# EAGLE design Electronicsmb (EAGLE 9.1.1)
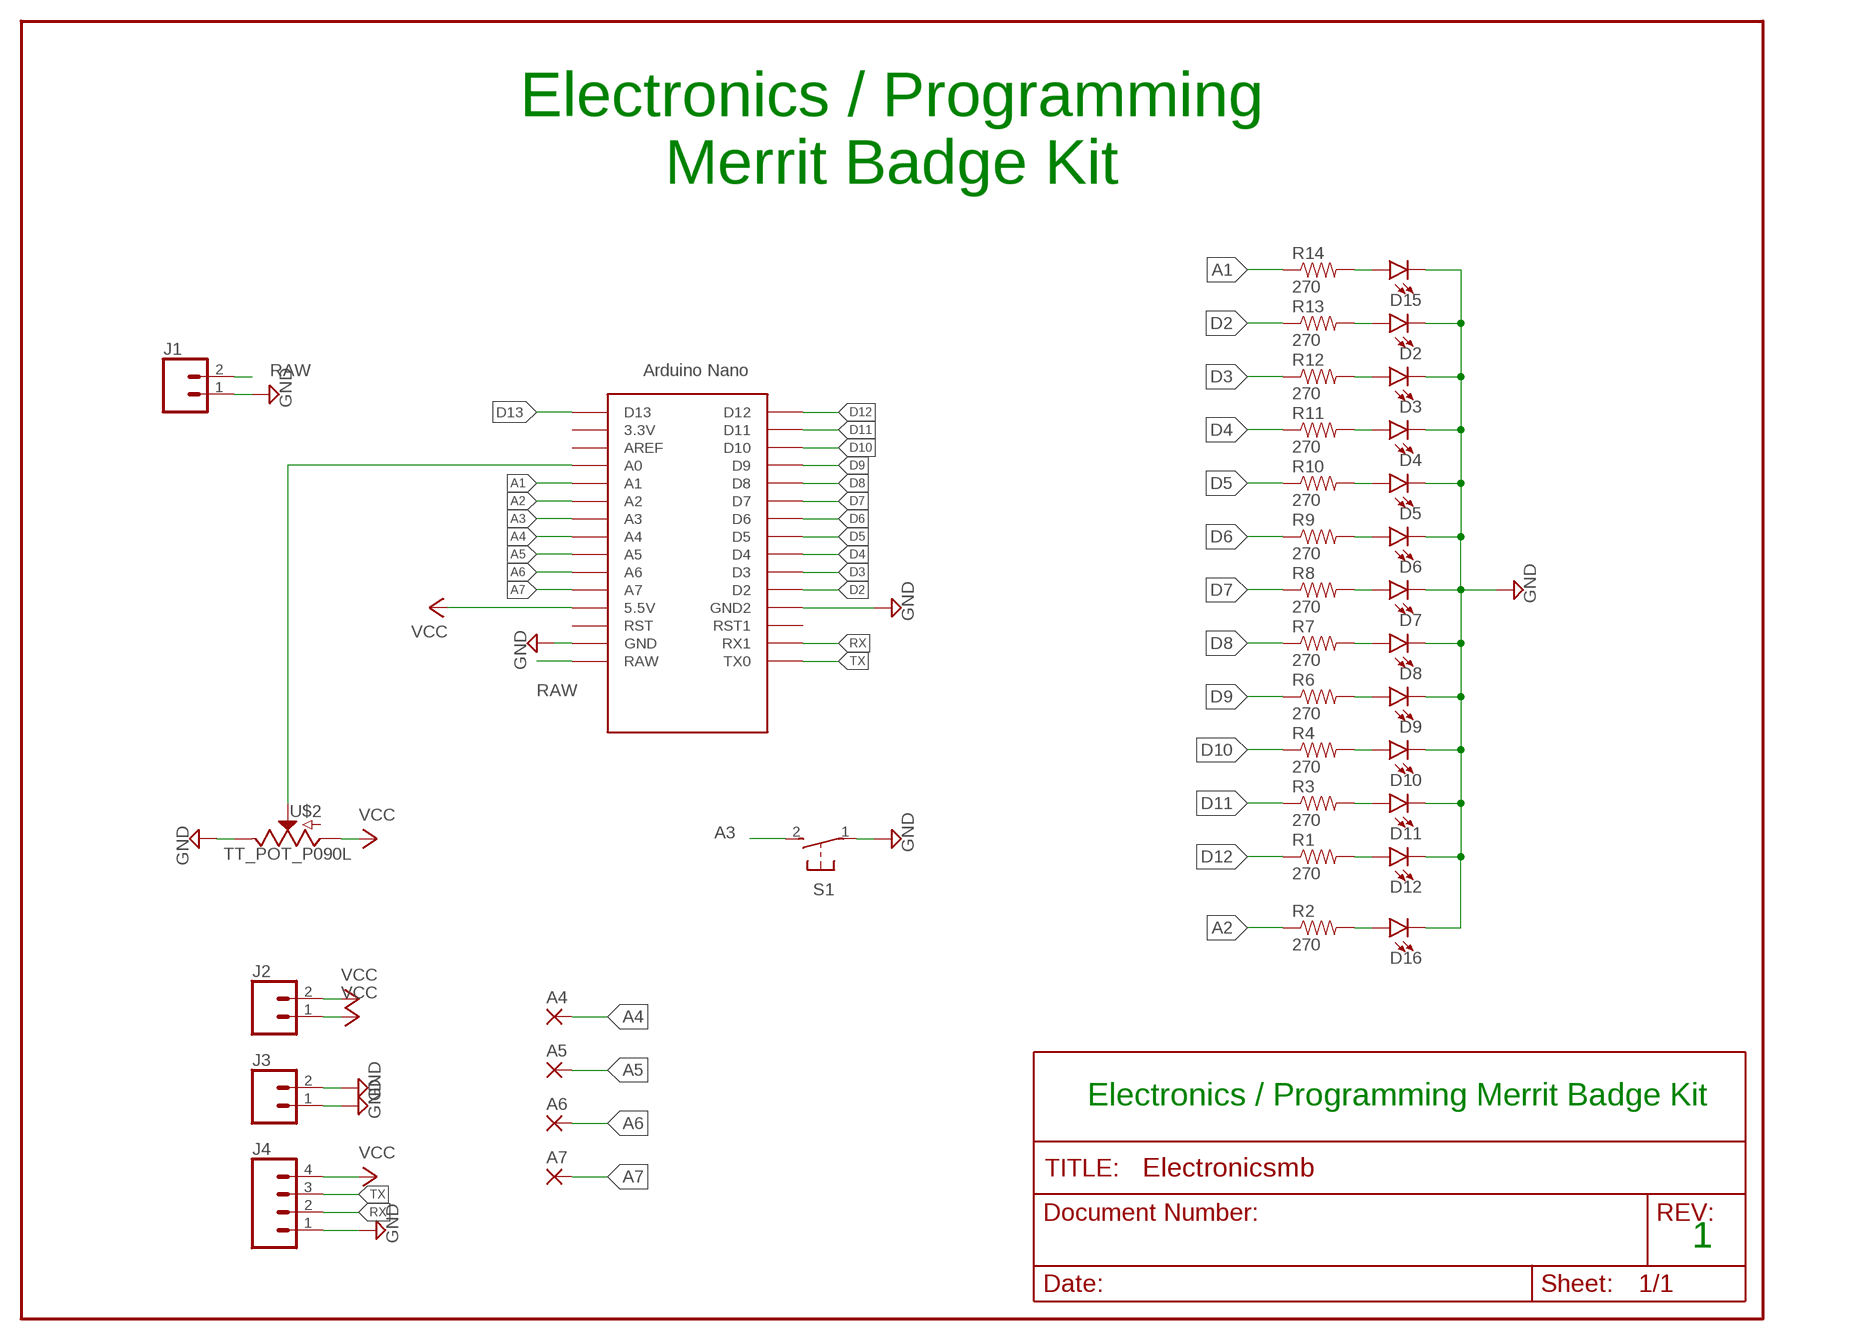
[diagram p0: schematic, sheet 1]

## Parts
A4  2,54/1,0  [2,54/1,0]
A5  2,54/1,0  [2,54/1,0]
A6  2,54/1,0  [2,54/1,0]
A7  2,54/1,0  [2,54/1,0]
D2  LED5MM  [LED_5MM]
D3  LED5MM  [LED_5MM]
D4  LED5MM  [LED_5MM]
D5  LED5MM  [LED_5MM]
D6  LED5MM  [LED_5MM]
D7  LED5MM  [LED_5MM]
D8  LED5MM  [LED_5MM]
D9  LED5MM  [LED_5MM]
D10  LED5MM  [LED_5MM]
D11  LED5MM  [LED_5MM]
D12  LED5MM  [LED_5MM]
D15  LED5MM  [LED_5MM]
D16  LED5MM  [LED_5MM]
J1  CONN_02  [1X02]
J2  CONN_02  [1X02]
J3  CONN_02  [1X02]
J4  CONN_04  [1X04]
R1  270  RESISTORPTH-1/4W  [AXIAL-0.4]
R2  270  RESISTORPTH-1/4W  [AXIAL-0.4]
R3  270  RESISTORPTH-1/4W  [AXIAL-0.4]
R4  270  RESISTORPTH-1/4W  [AXIAL-0.4]
R6  270  RESISTORPTH-1/4W  [AXIAL-0.4]
R7  270  RESISTORPTH-1/4W  [AXIAL-0.4]
R8  270  RESISTORPTH-1/4W  [AXIAL-0.4]
R9  270  RESISTORPTH-1/4W  [AXIAL-0.4]
R10  270  RESISTORPTH-1/4W  [AXIAL-0.4]
R11  270  RESISTORPTH-1/4W  [AXIAL-0.4]
R12  270  RESISTORPTH-1/4W  [AXIAL-0.4]
R13  270  RESISTORPTH-1/4W  [AXIAL-0.4]
R14  270  RESISTORPTH-1/4W  [AXIAL-0.4]
S1  31-XX  [B3F-31XX]
U$1  NANO  [NANO]
U$2  TT_POT_P090L  [TT_POT]

## Nets
A1: R14.P$1 U$1.A1
A2: R2.P$1 U$1.A2
A3: S1.2(S) U$1.A3
A4: A4.1(P) U$1.A4
A5: A5.1(P) U$1.A5
A6: A6.1(P) U$1.A6
A7: A7.1(P) U$1.A7
D2: R13.P$1 U$1.D2
D3: R12.P$1 U$1.D3
D4: R11.P$1 U$1.D4
D5: R10.P$1 U$1.D5
D6: R9.P$1 U$1.D6
D7: R8.P$1 U$1.D7
D8: R7.P$1 U$1.D8
D9: R6.P$1 U$1.D9
D10: R4.P$1 U$1.D10
D11: R3.P$1 U$1.D11
D12: R1.P$1 U$1.D12
D13: U$1.D13
GND: D2.K(C) D3.K(C) D4.K(C) D5.K(C) D6.K(C) D7.K(C) D8.K(C) D9.K(C) D10.K(C) D11.K(C) D12.K(C) D15.K(C) D16.K(C) J1.1 J3.1 J3.2 J4.1 S1.1(P) U$1.GND U$1.GND1(GND2) U$2.P$3(E)
N$13: D16.A R2.P$2
N$15: D15.A R14.P$2
N$16: D2.A R13.P$2
N$17: D3.A R12.P$2
N$18: D4.A R11.P$2
N$19: D5.A R10.P$2
N$20: D6.A R9.P$2
N$21: D7.A R8.P$2
N$22: D8.A R7.P$2
N$23: D9.A R6.P$2
N$24: D10.A R4.P$2
N$25: D11.A R3.P$2
N$26: D12.A R1.P$2
N$27: U$1.A0 U$2.P$2(S)
RAW: J1.2 U$1.RAW
RX: J4.2 U$1.RX1
TX: J4.3 U$1.TX0
VCC: J2.1 J2.2 J4.4 U$1.5V(5.5V) U$2.P$1(A)
Unconnected: U$1.3.3V U$1.AREF U$1.ICSP1 U$1.ICSP2 U$1.ICSP3 U$1.ICSP4 U$1.ICSP5 U$1.ICSP6 U$1.RST U$1.RST1

## Notes on the sheet
- Electronics / Programming
  Merrit Badge Kit
- Electronics / Programming Merrit Badge Kit
- 1

## Library data of the parts
A4-A7 = wirepad:2,54/1,0: THROUGH-HOLE PAD
D2-D12 D15 D16 = SparkFun-LED:LED: LED (Generic) Standard schematic elements and footprints for 5mm, 3mm, 1206, and 0603 sized LEDs. Generic LEDs with no color specified.
J1-J3 = SparkFun-Connectors:CONN_02: Multi connection point. Often used as Generic Header-pin footprint for 0.1 inch spaced/style header connections On any of the 0.1 inch spaced packages, you can populate with these: Break Away Headers - Straight <https://www.sparkfun.com/products/116> (PRT-00116) Break Away Male Headers - Right Angle <https://www.sparkfun.com/products/553> (PRT-00553) Female Headers <https://www.sparkfun.com/products/115> (PRT-00115) Break Away Headers - Machine Pin <https://www.sparkfun.com/products/117> (PRT-00117) Break Away Female Headers - Swiss Machine Pin <https://www.sparkfun.com/products/743> (PRT-00743) For SCREWTERMINALS and SPRING TERMINALS visit here: Screw Terimnals on SparkFun.com <https://www.sparkfun.com/search/results?term=Screw+Terminals> (5mm/3.5mm/2.54mm spacing) This device is also useful as a general connection point to wire up your design to another part of your project. Our various solder wires solder well into these plated through hole pads. Hook-Up Wire - Assortment (Stranded, 22 AWG) <https://www.sparkfun.com/products/11375> (PRT-11375) Hook-Up Wire - Assortment (Solid Core, 22 AWG) <https://www.sparkfun.com/products/11367> (PRT-11367) View the entire wire category on our website here <https://www.sparkfun.com/categories/141> Special notes: Molex polarized connector foot print use with: PRT-08233 with associated crimp pins and housings. 2.54_SCREWTERM for use with PRT-10571. 3.5mm Screw Terminal footprints for PRT-08084 5mm Screw Terminal footprints for use with PRT-08432
J4 = SparkFun-Connectors:CONN_04: Multi connection point. Often used as Generic Header-pin footprint for 0.1 inch spaced/style header connections On any of the 0.1 inch spaced packages, you can populate with these: Break Away Headers - Straight <https://www.sparkfun.com/products/116> (PRT-00116) Break Away Male Headers - Right Angle <https://www.sparkfun.com/products/553> (PRT-00553) Female Headers <https://www.sparkfun.com/products/115> (PRT-00115) Break Away Headers - Machine Pin <https://www.sparkfun.com/products/117> (PRT-00117) Break Away Female Headers - Swiss Machine Pin <https://www.sparkfun.com/products/743> (PRT-00743) For SCREWTERMINALS and SPRING TERMINALS visit here: Screw Terimnals on SparkFun.com <https://www.sparkfun.com/search/results?term=Screw+Terminals> (5mm/3.5mm/2.54mm spacing) This device is also useful as a general connection point to wire up your design to another part of your project. Our various solder wires solder well into these plated through hole pads. Hook-Up Wire - Assortment (Stranded, 22 AWG) <https://www.sparkfun.com/products/11375> (PRT-11375) Hook-Up Wire - Assortment (Solid Core, 22 AWG) <https://www.sparkfun.com/products/11367> (PRT-11367) View the entire wire category on our website here <https://www.sparkfun.com/categories/141> Special notes: Molex polarized connector foot print use with SKU : PRT-08231 with associated crimp pins and housings. 1MM SMD Version SKU: PRT-10208; PROD_ID: CONN-09696
R1-R4 R6-R14 = SparkFun:RESISTOR: Resistor Basic schematic elements and footprints for 0603, 1206, and PTH resistors.
S1 = switch-omron:31-XX: OMRON SWITCH; MPN: B3F-3100; OC_FARNELL: 959704; OC_NEWARK: 36M3582
U$1 = Arduino-clone:NANO: Arduino Nano
U$2 = homemadehamcustom:TT_POT_P090L

## Board
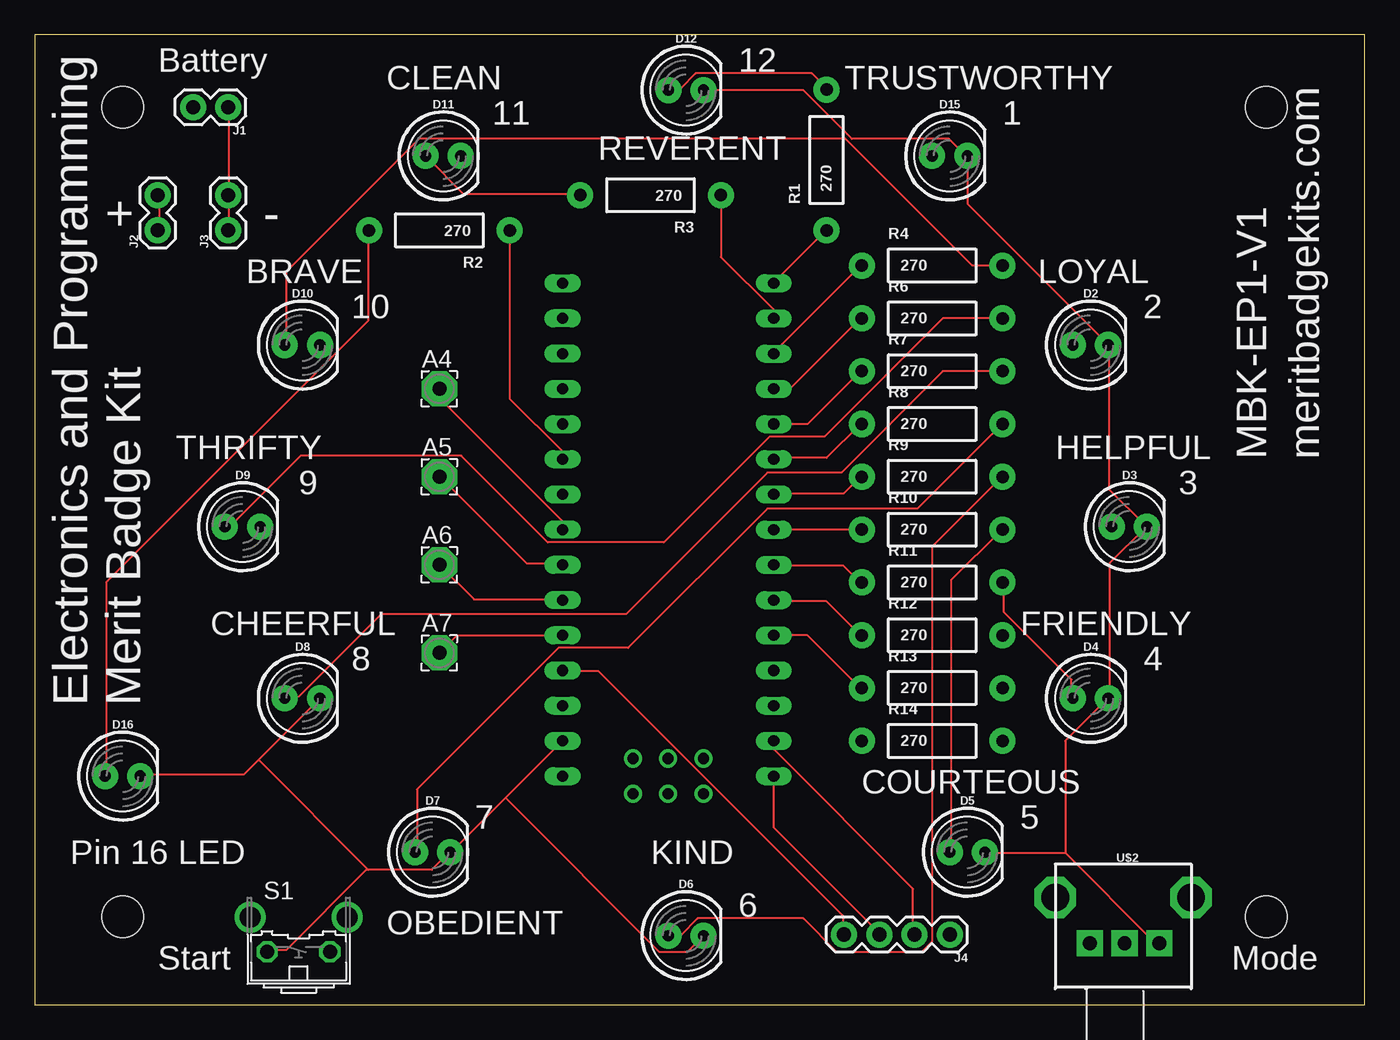
[diagram p1: board, top side]
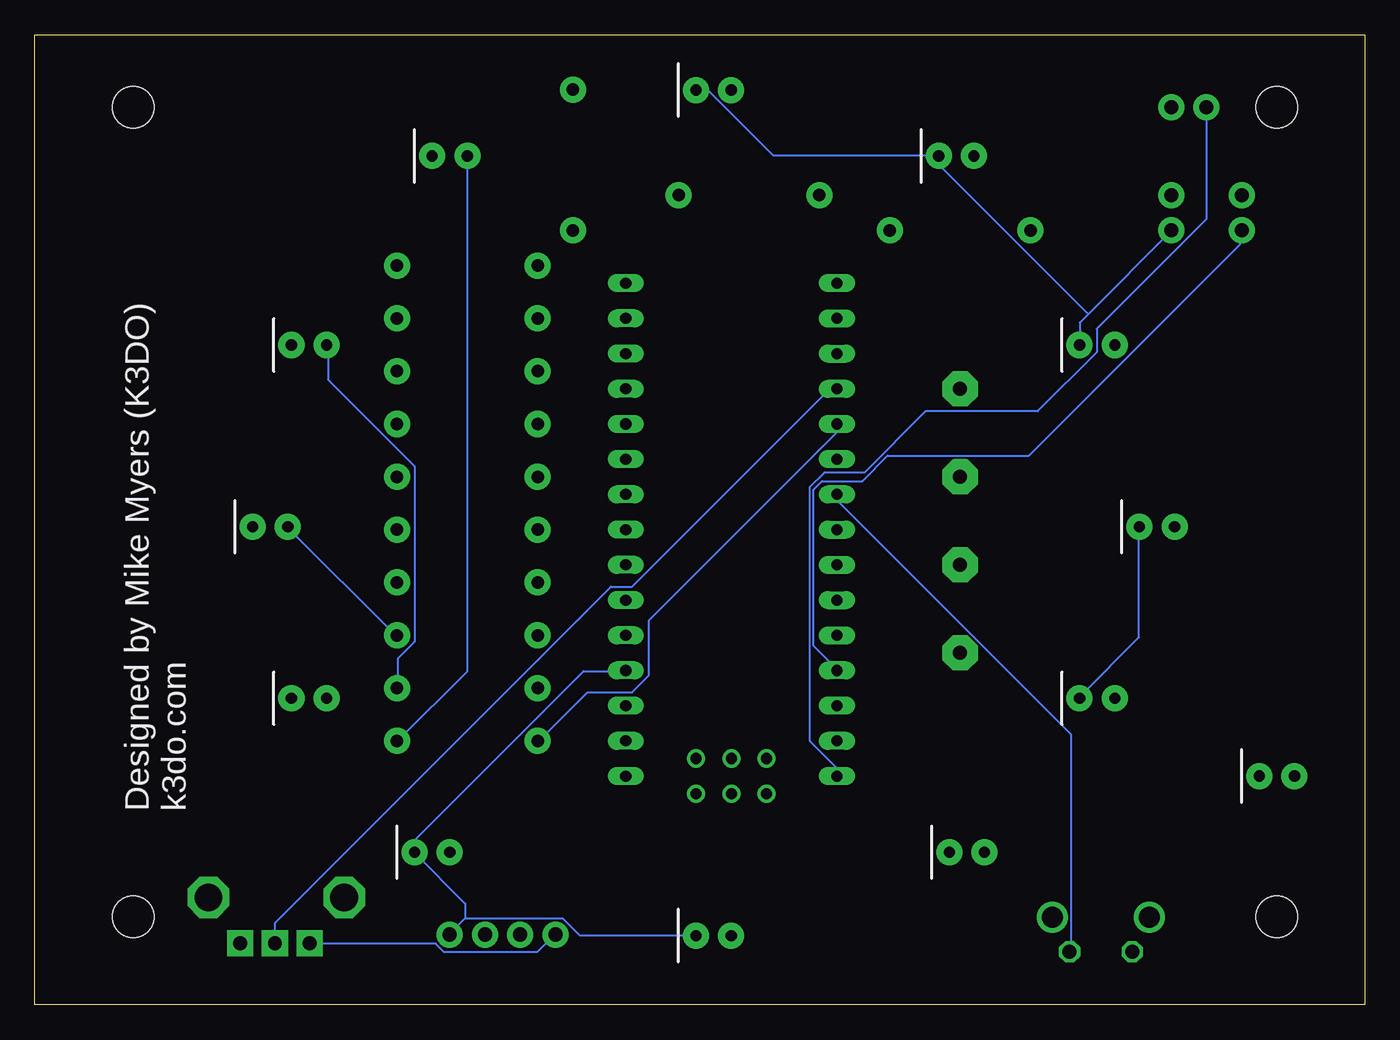
[diagram p2: board, bottom side, seen from below]

Size 96 x 70 mm. Coordinates in mm from the lower left corner, seen from the top.
Outline: 0,0 96,0 96,70 0,70 0,0
Copper layers (1*16): Top 0.035mm / dielectric 1.5mm / Bottom 0.035mm
Design rules "default": minimum track width 6mil, minimum drill 0.35mm, track to track 6mil, track to pad 6mil, pad to pad 6mil, via to via 6mil, smd to smd 6mil, copper to edge 40mil, drill to drill 6mil, minimum pad ring 10mil, minimum via ring 8mil, stop-mask expansion 4mil, vias tented up to drill 0mil, thermal gap 10mil
Holes 3 mm at 6.35,6.35 6.35,64.77 88.9,64.77 88.9,6.35

### Footprints (pad centres in the part's own frame; a part is rotated, then mirrored left to right if it is on the bottom)
2,54/1,0 = drill 1.016 pad 2.54 octagon: 1 0,0
LED_5MM = drill 0.813 pad 1.88: A -1.27,0; K 1.27,0
1X02 = drill 1.016 pad 1.88: 1 0,0; 2 2.54,0
1X04 = drill 1.016 pad 1.88: 1 0,0; 2 2.54,0; 3 5.08,0; 4 7.62,0
AXIAL-0.4 = drill 0.9 pad 1.88: P$1 -5.08,0; P$2 5.08,0
B3F-31XX = drill 1.016 octagon: 1 -2.261,-1.245; 2 2.261,-1.245 | drill 1.499 pad 2.159: 3 -3.505,1.245; 4 3.505,1.245
NANO = drill 0.8 long: 3.3V -10.16,24.13; 5V -10.16,-1.27; A0 -10.16,19.05; A1 -10.16,16.51; A2 -10.16,13.97; A3 -10.16,11.43; A4 -10.16,8.89; A5 -10.16,6.35; A6 -10.16,3.81; A7 -10.16,1.27; AREF -10.16,21.59; D2 5.08,1.27; D3 5.08,3.81; D4 5.08,6.35; D5 5.08,8.89; D6 5.08,11.43; D7 5.08,13.97; D8 5.08,16.51; D9 5.08,19.05; D10 5.08,21.59; D11 5.08,24.13; D12 5.08,26.67; D13 -10.16,26.67; GND -10.16,-6.35; GND1 5.08,-1.27; RAW -10.16,-8.89; RST -10.16,-3.81; RST1 5.08,-3.81; RX1 5.08,-6.35; TX0 5.08,-8.89 | drill 0.8: ICSP1 -5.08,-10.16; ICSP2 -5.08,-7.62; ICSP3 -2.54,-10.16; ICSP4 -2.54,-7.62; ICSP5 0,-10.16; ICSP6 0,-7.62
TT_POT = drill 1 pad 1.88 square: P$1 5.7,2.5; P$2 5.7,5; P$3 5.7,7.5 | drill 2 octagon: P$4 2.4,0; P$5 2.4,9.8

### Placement (x,y rotation side)
A4  29.21,44.45 0 top
A5  29.21,38.1 0 top
A6  29.21,31.75 0 top
A7  29.21,25.4 0 top
D2  76.2,47.61 0 top
D3  79,34.5 0 top
D4  76.2,22.12 0 top
D5  67.31,11.02 0 top
D6  47,5 0 top
D7  28.72,11.02 0 top
D8  19.32,22.12 0 top
D9  15,34.5 0 top
D10  19.32,47.61 0 top
D11  29.48,61.25 0 top
D12  47,66 0 top
D15  66.04,61.25 0 top
D16  6.35,16.51 0 top
J1  13.97,64.77 180 top
J2  8.89,55.88 90 top
J3  13.97,55.88 90 top
J4  66.04,5.08 180 top
R1  57.15,60.96 90 top
R2  29.21,55.88 180 top
R3  44.45,58.42 180 top
R4  64.77,53.34 0 top
R6  64.77,49.53 0 top
R7  64.77,45.72 0 top
R8  64.77,41.91 0 top
R9  64.77,38.1 0 top
R10  64.77,34.29 0 top
R11  64.77,30.48 0 top
R12  64.77,26.67 0 top
R13  64.77,22.86 0 top
R14  64.77,19.05 0 top
S1  19.05,5.08 0 top
U$1  48.26,25.4 0 top
U$2  73.66,10.16 270 top

### Tracks (layer width: path | path; a pad name or v marks a point on that pad's centre or on a via)
A1
  Bottom 0.152: U$1.A1 38.1,41.3 51.66,27.74 51.66,23.77 52.88,22.55 56.08,22.55 59.59,19.05 R14.P$1
A2
  Top 0.152: U$1.A2 38.1,39.47 38.1,39.93 34.29,43.74 34.29,55.78 R2.P$1
A3
  Bottom 0.152: U$1.A3 38.1,36.73 38.1,36.42 21.18,19.51 21.18,3.96 S1.2
A4
  Top 0.152: U$1.A4 38.1,34.9 29.26,43.74 29.26,44.35 A4.1
A5
  Top 0.152: U$1.A5 38.1,31.85 35.51,31.85 29.26,38.1 A5.1
A6
  Top 0.152: U$1.A6 38.1,29.26 31.7,29.26 29.26,31.7 A6.1
A7
  Top 0.152: U$1.A7 30.48,26.67 29.26,25.45 A7.1
D2
  Top 0.152: U$1.D2 55.78,26.67 59.59,22.86 R13.P$1
D3
  Top 0.152: U$1.D3 53.34,29.11 57.15,29.11 59.59,26.67 R12.P$1
D4
  Top 0.152: U$1.D4 53.34,31.7 58.37,31.7 59.59,30.48 R11.P$1
D5
  Top 0.152: U$1.D5 59.59,34.29 R10.P$1
D6
  Top 0.152: U$1.D6 53.34,36.88 58.37,36.88 59.59,38.1 R9.P$1
D7
  Top 0.152: U$1.D7 53.34,39.47 57.15,39.47 59.59,41.91 R8.P$1
D8
  Top 0.152: U$1.D8 55.78,41.91 59.59,45.72 R7.P$1
D9
  Top 0.152: U$1.D9 53.34,44.5 54.56,44.5 59.59,49.53 R6.P$1
D10
  Top 0.152: U$1.D10 53.34,47.09 59.59,53.34 R4.P$1
D11
  Top 0.152: U$1.D11 53.34,50.14 49.53,53.95 49.53,58.37 R3.P$1
D12
  Top 0.152: U$1.D12 53.34,52.12 57.15,55.93 R1.P$1
GND
  Top 0.152: 16.15,17.68 20.57,22.1 D8.K | 16.15,17.68 15.09,16.61 7.62,16.61 D16.K | 33.98,14.94 30.02,10.97 D7.K 29.87,10.97 28.65,9.75 24.08,9.75 | 33.98,14.94 U$1.GND | 24.08,9.75 23.93,9.75 18.14,3.96 16.92,3.96 S1.1 | 24.08,9.75 16.15,17.68 | J3.1 14.02,55.93 14.02,58.37 J3.2 14.02,58.52 14.02,64.77 J1.1 | 74.37,10.97 80.77,4.57 81.08,4.57 U$2.P$3 | 74.37,10.97 68.58,10.97 D5.K | 74.37,10.97 74.37,19.05 77.42,22.1 D4.K 77.57,22.25 77.57,31.85 80.16,34.44 D3.K 80.16,34.59 77.57,37.19 77.57,47.55 D2.K 77.42,47.7 67.36,57.76 67.36,61.11 D15.K 67.21,61.27 65.99,62.48 58.98,62.48 55.47,65.99 48.31,65.99 D12.K | 33.98,14.94 45.11,3.81 47.09,3.81 48.16,4.88 D6.K
  Bottom 0.152: D9.K 16.31,34.44 16.31,26.52 20.57,22.25 D8.K | 19.96,49.84 14.02,55.78 J3.1 | 19.96,49.84 20.57,49.23 20.57,47.7 D10.K | 19.96,49.84 30.63,60.5 30.63,61.11 D11.K 30.79,61.27 42.67,61.27 47.4,65.99 48.16,65.99 D12.K | 64.92,6.25 57.91,6.25 56.69,5.03 48.31,5.03 D6.K | 64.92,6.25 65.99,5.18 J4.1 | U$1.GND1 53.34,24.08 56.39,24.08 68.58,11.89 68.58,11.12 D5.K 68.58,10.97 64.92,7.32 64.92,6.25
N$13
  Top 0.152: D16.A 5.18,16.61 5.18,30.48 24.08,49.38 24.08,55.78 R2.P$2
N$15
  Bottom 0.152: D15.A 64.77,61.11 64.77,24.08 69.8,19.05 R14.P$2
N$16
  Bottom 0.152: R13.P$2 69.8,22.86 69.8,24.99 68.58,26.21 68.58,38.86 74.83,45.11 74.83,47.55 D2.A
N$17
  Bottom 0.152: R12.P$2 69.95,26.67 77.72,34.44 D3.A
N$18
  Top 0.152: R11.P$2 69.95,30.48 69.95,28.35 74.83,23.47 74.83,22.25 D4.A
N$19
  Top 0.152: D5.A 66.14,11.12 66.14,30.63 69.8,34.29 R10.P$2
N$20
  Top 0.152: D6.A 45.87,5.03 46.63,5.03 47.85,6.25 55.47,6.25 57.91,3.81 64.01,3.81 64.77,4.57 64.77,33.07 69.8,38.1 R9.P$2
N$21
  Top 0.152: D7.A 27.58,11.12 27.58,15.54 37.8,25.76 42.82,25.76 52.88,35.81 63.7,35.81 69.8,41.91 R8.P$2
N$22
  Top 0.152: D8.A 18.14,22.25 19.05,22.25 24.99,28.19 42.67,28.19 52.88,38.41 58.22,38.41 65.53,45.72 69.8,45.72 R7.P$2
N$23
  Top 0.152: D9.A 13.87,34.59 14.17,34.59 19.2,39.62 30.79,39.62 37.03,33.38 45.41,33.38 53.03,41 57,41 65.53,49.53 69.8,49.53 R6.P$2
N$24
  Top 0.152: D10.A 18.14,47.7 18.14,52.88 27.74,62.48 58.52,62.48 67.67,53.34 69.8,53.34 R4.P$2
N$25
  Top 0.152: R3.P$2 39.32,58.52 30.94,58.52 28.35,61.11 D11.A
N$26
  Top 0.152: D12.A 45.87,66.14 46.63,66.14 47.7,67.21 56.08,67.21 57.15,66.14 R1.P$2
N$27
  Bottom 0.152: U$1.A0 38.1,44.35 38.71,44.35 52.88,30.18 54.41,30.18 78.64,5.94 78.64,4.57 U$2.P$2
RAW
  Bottom 0.152: J1.2 11.43,56.69 19.36,48.77 19.36,47.09 23.62,42.82 31.7,42.82 36.12,38.41 39.01,38.41 40.08,37.34 40.08,19.05 38.1,17.07 38.1,16.61 U$1.RAW
RX
  Top 0.152: U$1.RX1 53.34,18.44 63.4,8.38 63.4,5.18 J4.2
TX
  Top 0.152: U$1.TX0 53.34,16.46 53.34,12.8 60.96,5.18 J4.3
VCC
  Top 0.152: J2.1 8.99,55.93 8.99,58.37 J2.2 | U$1.5V 38.1,24.08 40.69,24.08 58.37,6.4 58.37,5.18 J4.4
  Bottom 0.152: U$2.P$1 76.05,4.42 67.06,4.42 66.45,3.81 59.74,3.81 58.52,5.03 J4.4 | J2.1 8.99,55.78 8.99,54.86 24.23,39.62 34.44,39.62 36.27,37.8 39.17,37.8 39.78,37.19 39.78,25.91 38.1,24.23 U$1.5V

### Text on the board
tPlace: Battery | CLEAN | 11 | + | -
tNames: 12 | TRUSTWORTHY | 1 | REVERENT | BRAVE | LOYAL | 10 | 2 | THRIFTY | HELPFUL | MBK-EP1-V1 | meritbadgekits.com | 9 | 3 | CHEERFUL | FRIENDLY | 8 | 4 | Electronics and Programming / Merit Badge Kit | COURTEOUS | 7 | 5 | Pin 16 LED | KIND | 6 | OBEDIENT | Start | Mode
bNames: Designed by Mike Myers (K3DO) / k3do.com